# EAGLE design XStepperLCD (EAGLE 6.6.0)
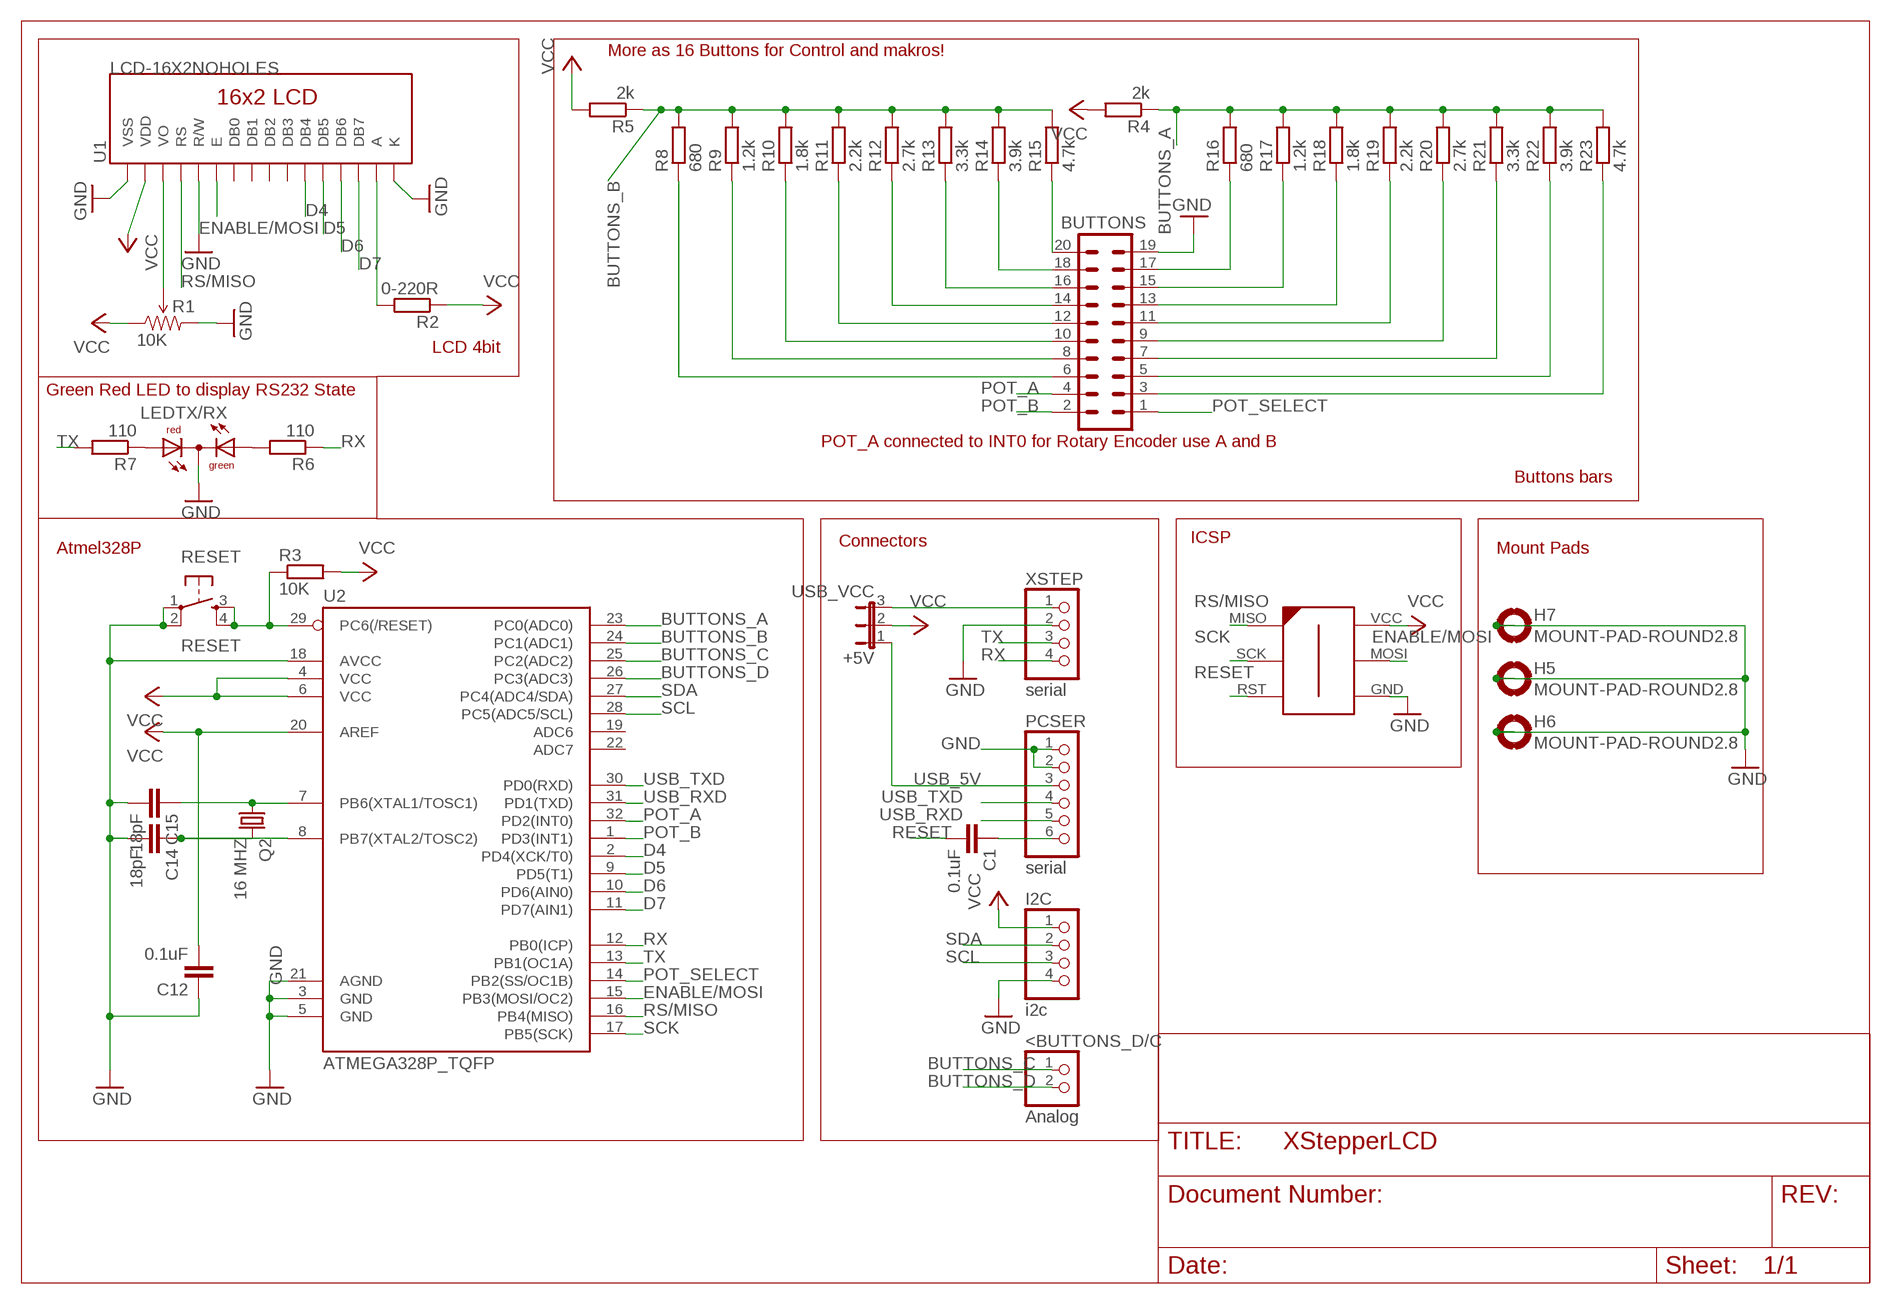
[diagram p0: schematic, sheet 1]

## Parts
+5V  USB_VCC  JP2E  [JP2]
<BUTTONS_D/C  Analog  PINHD-1X2  [1X02]
BUTTONS  ML20  [ML20]
C1  0.1uF  C-EUC1206  [C1206]
C12  0.1uF  C-EUC1206  [C1206]
C14  18pF  C-EUC1206  [C1206]
C15  18pF  C-EUC1206  [C1206]
H5  MOUNT-PAD-ROUND2.8  [2,8-PAD]
H6  MOUNT-PAD-ROUND2.8  [2,8-PAD]
H7  MOUNT-PAD-ROUND2.8  [2,8-PAD]
I2C  i2c  PINHD-1X4/90  [1X04/90]
ICSP  ICSP  AVR-ISP-6-EDGE  [6PAD_ISP]
LEDTX/RX  DUOLED2X5  [DUOLED2X5]
PCSER  serial  PINHD-1X6/90  [1X06/90]
Q2  16 MHZ  CRYSTALHC49S  [HC49/S]
R1  10K  TRIMPOT3362U-2  [3362U-2]
R2  0-220R  R-EU_R1206  [R1206]
R3  10K  R-EU_R1206  [R1206]
R4  2k  R-EU_R1206  [R1206]
R5  2k  R-EU_R1206  [R1206]
R6  110  R-EU_R1206  [R1206]
R7  110  R-EU_R1206  [R1206]
R8  680  R-EU_R1206  [R1206]
R9  1.2k  R-EU_R1206  [R1206]
R10  1.8k  R-EU_R1206  [R1206]
R11  2.2k  R-EU_R1206  [R1206]
R12  2.7k  R-EU_R1206  [R1206]
R13  3.3k  R-EU_R1206  [R1206]
R14  3.9k  R-EU_R1206  [R1206]
R15  4.7k  R-EU_R1206  [R1206]
R16  680  R-EU_R1206  [R1206]
R17  1.2k  R-EU_R1206  [R1206]
R18  1.8k  R-EU_R1206  [R1206]
R19  2.2k  R-EU_R1206  [R1206]
R20  2.7k  R-EU_R1206  [R1206]
R21  3.3k  R-EU_R1206  [R1206]
R22  3.9k  R-EU_R1206  [R1206]
R23  4.7k  R-EU_R1206  [R1206]
RESET  RESET  TAC_SWITCHSMD  [TACTILE_SWITCH_SMD]
U1  LCD-16X2NOHOLES  [LCD-16X2_NOHOLES]
U2  ATMEGA328P_TQFP  [TQFP32-08]
XSTEP  serial  PINHD-1X4/90  [1X04/90]

## Nets
BUTTONS_A: R4.1 R16.2 R17.2 R18.2 R19.2 R20.2 R21.2 R22.2 R23.2 U2.23(PC0(ADC0))
BUTTONS_B: R5.1 R8.2 R9.2 R10.2 R11.2 R12.2 R13.2 R14.2 R15.2 U2.24(PC1(ADC1))
BUTTONS_C: <BUTTONS_D/C.1 U2.25(PC2(ADC2))
BUTTONS_D: <BUTTONS_D/C.2 U2.26(PC3(ADC3))
D4: U1.11(DB4) U2.2(PD4(XCK/T0))
D5: U1.12(DB5) U2.9(PD5(T1))
D6: U1.13(DB6) U2.10(PD6(AIN0))
D7: U1.14(DB7) U2.11(PD7(AIN1))
ENABLE/MOSI: ICSP.MOSI U1.6(E) U2.15(PB3(MOSI/OC2))
GND: BUTTONS.19 C12.1 C14.2 C15.2 H5.B2,8(MOUNT) H6.B2,8(MOUNT) H7.B2,8(MOUNT) I2C.4 ICSP.GND LEDTX/RX.K(C) PCSER.1 PCSER.2 R1.3(CW) RESET.1 RESET.2 U1.1(VSS) U1.5(R/W) U1.16(K) U2.3(GND) U2.5(GND) U2.18(AVCC) U2.21(AGND) XSTEP.2
N$1: R1.2(WIPER) U1.3(VO)
N$2: R2.2 U1.15(A)
N$4: BUTTONS.13 R18.1
N$5: BUTTONS.15 R17.1
N$6: BUTTONS.17 R16.1
N$7: BUTTONS.6 R8.1
N$8: BUTTONS.8 R9.1
N$9: BUTTONS.3 R23.1
N$10: BUTTONS.5 R22.1
N$11: BUTTONS.10 R10.1
N$12: BUTTONS.12 R11.1
N$13: BUTTONS.14 R12.1
N$14: C1.1 PCSER.6
N$15: BUTTONS.16 R13.1
N$16: BUTTONS.7 R21.1
N$17: BUTTONS.9 R20.1
N$18: BUTTONS.11 R19.1
N$19: BUTTONS.18 R14.1
N$20: BUTTONS.20 R15.1
N$21: LEDTX/RX.AG R6.2
N$22: LEDTX/RX.AR R7.1
N$33: C15.1 Q2.1 U2.7(PB6(XTAL1/TOSC1))
N$34: C14.1 Q2.2 U2.8(PB7(XTAL2/TOSC2))
POT_A: BUTTONS.4 U2.32(PD2(INT0))
POT_B: BUTTONS.2 U2.1(PD3(INT1))
POT_SELECT: BUTTONS.1 U2.14(PB2(SS/OC1B))
RESET: C1.2 ICSP.RST R3.1 RESET.3 RESET.4 U2.29(PC6(/RESET))
RS/MISO: ICSP.MISO U1.4(RS) U2.16(PB4(MISO))
RX: R6.1 U2.12(PB0(ICP)) XSTEP.4
SCK: ICSP.SCK U2.17(PB5(SCK))
SCL: I2C.3 U2.28(PC5(ADC5/SCL))
SDA: I2C.2 U2.27(PC4(ADC4/SDA))
TX: R7.2 U2.13(PB1(OC1A)) XSTEP.3
USB_5V: +5V.1 PCSER.3
USB_RXD: PCSER.5 U2.31(PD1(TXD))
USB_TXD: PCSER.4 U2.30(PD0(RXD))
VCC [power]: +5V.2 C12.2 I2C.1 ICSP.VCC R1.1(CCW) R2.1 R3.2 R4.2 R5.2 U1.2(VDD) U2.4(VCC) U2.6(VCC)
XSTEP_5V: +5V.3 XSTEP.1
Unconnected: U1.7(DB0) U1.8(DB1) U1.9(DB2) U1.10(DB3) U2.19(ADC6) U2.20(AREF) U2.22(ADC7)

## Notes on the sheet
- More as 16 Buttons for Control and makros!
- LCD 4bit
- Green Red LED to display RS232 State
- POT_A connected to INT0 for Rotary Encoder use A and B
- Buttons bars
- Connectors | ICSP
- Atmel328P | Mount Pads

## Library data of the parts
+5V = jumper:JP2E: JUMPER
<BUTTONS_D/C = pinhead:PINHD-1X2: PIN HEADER
BUTTONS = con-ml:ML20: HARTING; OC_FARNELL: unknown; OC_NEWARK: unknown
C1 C12 C14 C15 = resistor:C-EU: CAPACITOR, European symbol
H5-H7 = holes:MOUNT-PAD-ROUND: MOUNTING PAD, round
I2C XSTEP = pinhead:PINHD-1X4: PIN HEADER
ICSP = avr-7:AVR-ISP-6-EDGE: 6 pin edge connector for ISP with ATMEL MCUs. Developed by Craig Moates (craig at moates dot net). Library by David Blundell (blundar at gmail dot com). Often, even a 6 pin header is really inconvenient for board layout and/or production. This SMD-only header is our de-facto standard for using an edge connector for programming with the help of a 6pin/10pin to edge card adapter.
LEDTX/RX = led:DUOLED2X5: DUO LED 2 colors, 2.5 x 5 mm, recangle
PCSER = pinhead:PINHD-1X6: PIN HEADER
Q2 = crystal:CRYSTAL: CRYSTAL; OC_FARNELL: 1667008; OC_NEWARK: unknown
R1 = SparkFun-Electromechanical:TRIMPOT: Various small potentiometers for "set-and-forget" applications
R2-R23 = resistor:R-EU_: RESISTOR, European symbol
RESET = SparkFun:TAC_SWITCH: Momentary Switch Button commonly used for reset or general input. Spark Fun Electronics SKU : COM-00097
U1 = SparkFun-Displays:LCD-16X2: Standard text-only 16x2 parallel input LCD
U2 = SparkFun-DigitalIC:ATMEGA328P_TQFP; PROD_ID: IC-09069

## Net classes
0 default: width 0.254 mm, clearance 0.203 mm
1 power: width 0.254 mm, clearance 0.203 mm

## Board
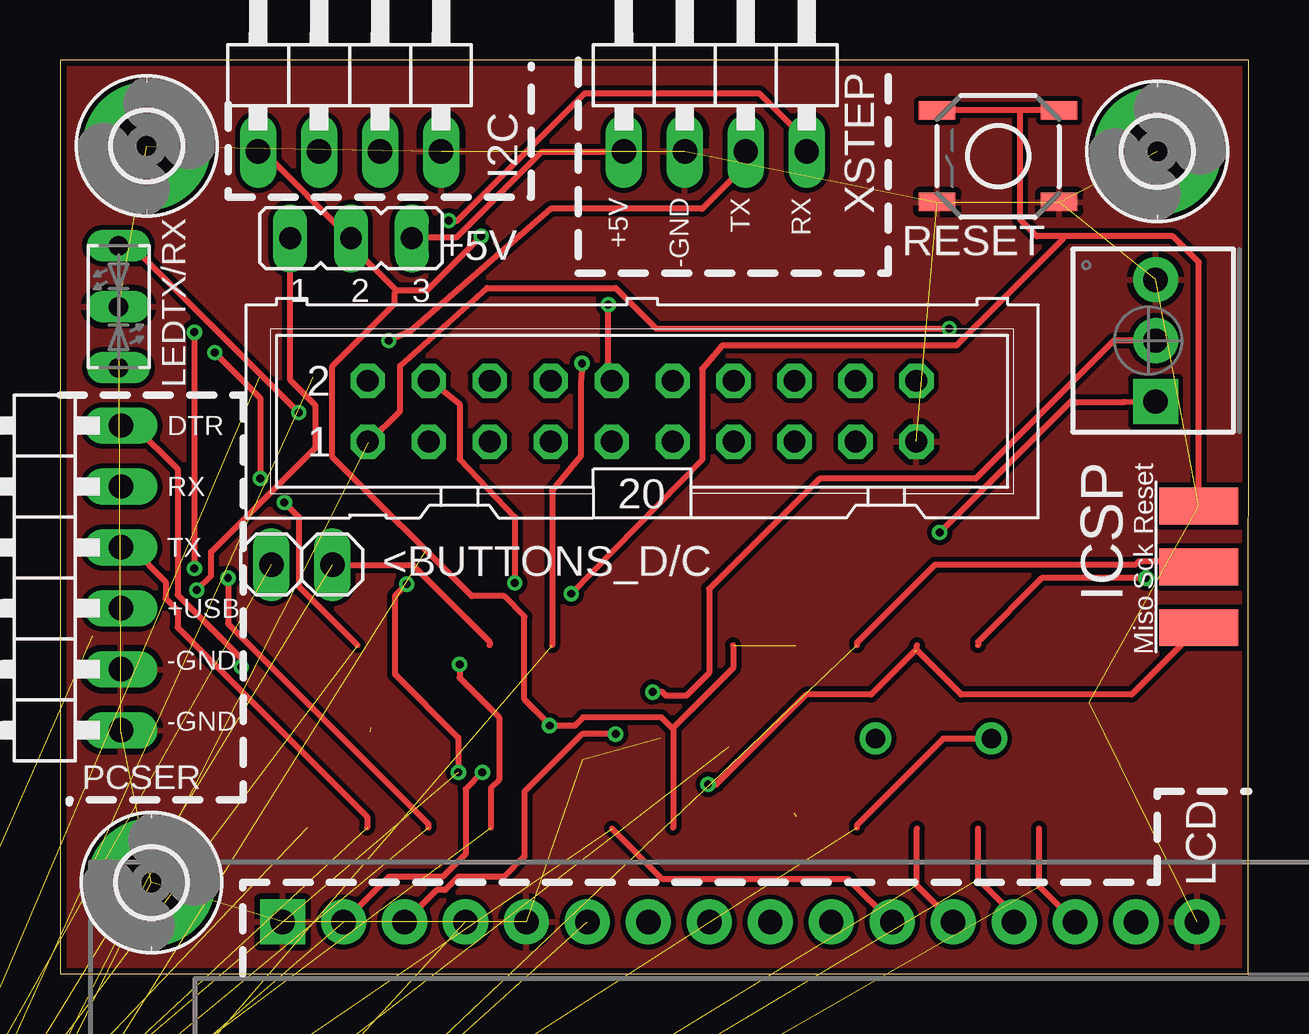
[diagram p1: board, top side]
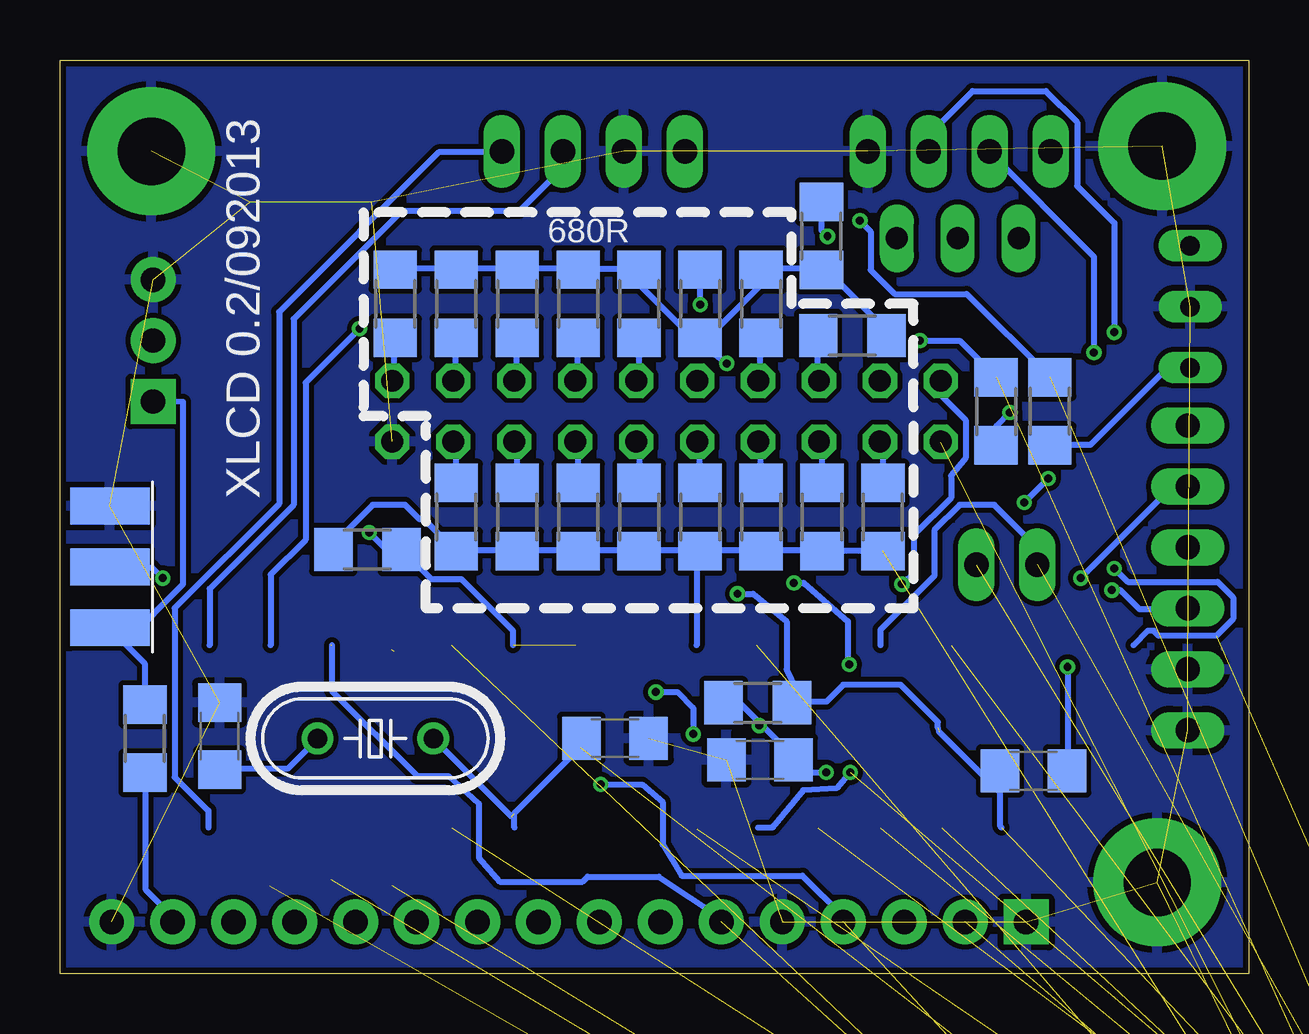
[diagram p2: board, bottom side, seen from below]

Size 49.53 x 38.1 mm. Coordinates in mm from the lower left corner, seen from the top.
Outline: 0,0 49.51,0 49.53,38.1 0,38.09 0,0
Copper layers (1*16): Top 0.035mm / dielectric 1.5mm / Bottom 0.035mm
Design rules "ITEADstudio_DRC": minimum track width 6mil, minimum drill 12mil, track to track 6mil, track to pad 6mil, pad to pad 6mil, via to via 6mil, smd to smd 0mil, copper to edge 10mil, drill to drill 10mil, minimum pad ring 10mil, minimum via ring 6mil, stop-mask expansion 2mil, vias tented up to drill 100mil, thermal gap 10mil

### Footprints (pad centres in the part's own frame; a part is rotated, then mirrored left to right if it is on the bottom)
JP2 = drill 0.914 long: 1 -2.54,0; 2 0,0; 3 2.54,0
1X02 = drill 1.016 long: 1 -1.27,0; 2 1.27,0
ML20 = drill 0.914 octagon: 1 -11.43,-1.27; 2 -11.43,1.27; 3 -8.89,-1.27; 4 -8.89,1.27; 5 -6.35,-1.27; 6 -6.35,1.27; 7 -3.81,-1.27; 8 -3.81,1.27; 9 -1.27,-1.27; 10 -1.27,1.27; 11 1.27,-1.27; 12 1.27,1.27; 13 3.81,-1.27; 14 3.81,1.27; 15 6.35,-1.27; 16 6.35,1.27; 17 8.89,-1.27; 18 8.89,1.27; 19 11.43,-1.27; 20 11.43,1.27
C1206 = smd 1.6 x 1.8: 1 -1.4,0; 2 1.4,0
2,8-PAD = drill 2.8 pad 5.334: B2,8 0,0
1X04/90 = drill 1.016 long: 1 -3.81,-3.81; 2 -1.27,-3.81; 3 1.27,-3.81; 4 3.81,-3.81
6PAD_ISP = smd 1.524 x 3.302 bottom: GND 2.54,0; MOSI 0,0; VCC -2.54,0 | smd 1.524 x 3.302: MISO -2.54,0; RST 2.54,0; SCK 0,0
DUOLED2X5 = drill 0.813 long: AG -2.54,0; AR 2.54,0; K 0,0
1X06/90 = drill 1.016 long: 1 -6.35,-3.81; 2 -3.81,-3.81; 3 -1.27,-3.81; 4 1.27,-3.81; 5 3.81,-3.81; 6 6.35,-3.81
HC49/S = drill 0.813: 1 -2.413,0; 2 2.413,0
3362U-2 = drill 1.016 pad 1.88 square: 1 -2.54,-0.305 | drill 1.016 pad 1.88: 2 0,-0.305; 3 2.54,-0.305
R1206 = smd 1.6 x 1.803: 1 -1.422,0; 2 1.422,0
TACTILE_SWITCH_SMD = smd 1.524 x 0.762: 1 -2.54,1.905; 2 2.54,1.905; 3 -2.54,-1.905; 4 2.54,-1.905
LCD-16X2_NOHOLES = drill 1.016 pad 1.88 square: 1 -32,15.5 | drill 1.016 pad 1.88: 2 -29.46,15.5; 3 -26.92,15.5; 4 -24.38,15.5; 5 -21.84,15.5; 6 -19.3,15.5; 7 -16.76,15.5; 8 -14.22,15.5; 9 -11.68,15.5; 10 -9.14,15.5; 11 -6.6,15.5; 12 -4.06,15.5; 13 -1.52,15.5; 14 1.02,15.5; 15 3.56,15.5; 16 6.1,15.5
TQFP32-08 = smd 1.27 x 0.559: 1 -4.293,2.8; 2 -4.293,2; 3 -4.293,1.2; 4 -4.293,0.4; 5 -4.293,-0.4; 6 -4.293,-1.2; 7 -4.293,-2; 8 -4.293,-2.8; 17 4.293,-2.8; 18 4.293,-2; 19 4.293,-1.2; 20 4.293,-0.4; 21 4.293,0.4; 22 4.293,1.2; 23 4.293,2; 24 4.293,2.8 | smd 0.559 x 1.27: 9 -2.8,-4.293; 10 -2,-4.293; 11 -1.2,-4.293; 12 -0.4,-4.293; 13 0.4,-4.293; 14 1.2,-4.293; 15 2,-4.293; 16 2.8,-4.293; 25 2.8,4.293; 26 2,4.293; 27 1.2,4.293; 28 0.4,4.293; 29 -0.4,4.293; 30 -1.2,4.293; 31 -2,4.293; 32 -2.8,4.293

### Placement (x,y rotation side)
+5V  12.12,30.67 0 top
<BUTTONS_D/C  10.08,17.06 180 top
BUTTONS  24.25,23.45 0 top
C1  8.96,8.46 180 bottom
C12  20.36,8.93 0 bottom
C14  42.88,9.91 90 bottom
C15  26.41,9.82 0 bottom
H5  3.61,34.52 0 top
H6  45.72,34.29 0 top
H7  3.81,3.81 0 top
I2C  12.06,38.1 0 top
ICSP  47.45,16.96 90 top
LEDTX/RX  2.44,27.82 90 top
PCSER  -1.27,16.51 90 top
Q2  36.39,9.81 180 bottom
R1  45.34,26.4 90 top
R2  45.99,9.81 270 bottom
R3  20.45,11.3 180 bottom
R4  36.72,17.69 0 bottom
R5  17.8,30.77 90 bottom
R6  8.29,23.45 270 bottom
R7  10.53,23.45 90 bottom
R8  16.52,26.61 0 bottom
R9  20.32,27.94 90 bottom
R10  22.86,27.94 270 bottom
R11  25.4,27.94 90 bottom
R12  27.94,27.94 90 bottom
R13  30.48,27.94 90 bottom
R14  33.02,27.94 90 bottom
R15  35.56,27.94 90 bottom
R16  33.02,19.05 270 bottom
R17  30.48,19.05 270 bottom
R18  27.94,19.05 270 bottom
R19  25.4,19.05 270 bottom
R20  22.86,19.05 270 bottom
R21  20.32,19.05 270 bottom
R22  17.78,19.05 270 bottom
R23  15.24,19.05 270 bottom
RESET  39.09,34.09 180 top
U1  41.27,-13.34 0 top
U2  -13.97,-24.13 0 top  (outside the outline)
XSTEP  27.3,38.1 0 top

### Tracks (layer width: path | path; a pad name or v marks a point on that pad's centre or on a via)
BUTTONS_A  (1 unrouted)
  Bottom 0.254: R23.2 15.25,17.65 17.75,17.65 R22.2 17.9,17.65 20.3,17.65 R21.2 20.4,17.65 22.85,17.65 R20.2 | R20.2 22.95,17.65 25.4,17.65 R19.2 25.5,17.65 27.9,17.65 R18.2 28.05,17.65 30.45,17.65 R17.2 30.6,17.65 33,17.65 R16.2 33.1,17.7 34.35,18.95 34.55,18.95 35.15,19.55 36.5,19.55 38.1,17.95 38.1,17.7 R4.1 | 23,13.7 23,17.55 R20.2
BUTTONS_B  (via drill 0.33)  (1 unrouted)
  Top 0.254: 20.5,13.7 20.5,20.15 21.7,21.6 21.7,24.62 v21.75,25.45
  Bottom 0.254: R15.2 35.55,29.4 33.1,29.4 R14.2 33,29.4 30.6,29.4 R13.2 30.45,29.4 28.05,29.4 R12.2 27.9,29.4 25.4,29.4 R11.2 25.35,29.25 25.35,28.7 23.25,26.6 22.95,26.6 R10.2 | R8.2 15.1,26.65 15.1,26.85 17.55,29.3 17.8,29.3 R5.1 17.9,29.4 20.3,29.4 R9.2 19.75,29.3 22.5,26.55 22.85,26.55 R10.2 | v21.75,25.45 22.32,25.9 22.45,26.45 R10.2
BUTTONS_C  (1 unrouted)
  Top 0.254: 17.9,13.7 17.9,13.85 14.7,17.05 <BUTTONS_D/C.1
BUTTONS_D  (1 unrouted)
  Bottom 0.254: 15.35,13.7 15.35,14.35 13.1,16.6 13.1,18.5 12.05,19.55 10.6,19.55 8.85,17.8 8.85,17.1 <BUTTONS_D/C.2
D4  (1 unrouted)
  Top 0.254: 23,6.05 25.1,3.95 32.85,3.95 34.65,2.15 U1.11
D5  (1 unrouted)
  Top 0.254: 35.7,6.05 35.7,3.7 37.2,2.2 U1.12
D6  (1 unrouted)
  Top 0.254: 38.25,6.05 38.25,3.95 39.75,2.45 39.75,2.2 U1.13
D7  (1 unrouted)
  Top 0.254: 40.8,6.05 40.8,3.65 42.25,2.2 U1.14
ENABLE/MOSI  (via drill 0.33)  (2 unrouted)
  Top 0.254: 38.25,13.7 38.25,13.85 40.9,16.5 v45.25,16.5
  Bottom 0.254: v45.25,16.5 45.7,16.95 ICSP.MOSI | 38.2,13.7 38.2,11.8 34.65,8.25 33.35,8.25 32.08,7.1 32.08,4.85 31.2,3.85 27.75,3.85 27.55,4.05 24.57,4.05 22,2.35 22,2.2 U1.6
GND  (22 unrouted)
  pour Bottom: 0,0 49.53,0 49.53,38.1 0,38.1
  pour Top: 0,38.1 49.53,38.1 49.53,0 0,0
N$1  (via drill 0.33)
  Top 0.254: v23.15,10 21.75,10 19.35,7.6 19.35,4.9 18.5,4.05 16.6,4.05 16.05,3.5 15.7,3.5 14.4,2.2 U1.3 | v24.7,11.75 25.1,11.75 25.25,11.6 26.1,11.6 27.05,12.55 27.05,16.05 31.65,20.65 38.15,20.65 43.9,26.4 R1.2
  Bottom 0.254: v23.15,10 23.15,11.1 23.8,11.75 v24.7,11.75
N$2
  Bottom 0.254: R2.2 45.95,8.35 45.95,3.5 44.85,2.4 44.85,2.2 U1.15
N$4
  Bottom 0.254: R18.1 27.95,20.5 27.95,22.05 28.05,22.15 BUTTONS.13
N$5
  Bottom 0.254: R17.1 30.5,20.5 30.5,22.05 30.6,22.15 BUTTONS.15
N$6
  Bottom 0.254: R16.1 33.05,20.5 33.05,22.1 33.1,22.15 BUTTONS.17
N$7
  Bottom 0.254: R8.1 17.95,24.75 BUTTONS.6
N$8
  Bottom 0.254: R9.1 20.35,26.5 20.35,24.8 20.4,24.75 BUTTONS.8
N$9
  Bottom 0.254: R23.1 15.25,20.5 15.25,22.05 15.35,22.15 BUTTONS.3
N$10
  Bottom 0.254: R22.1 17.8,20.5 17.8,22.05 17.9,22.15 BUTTONS.5
N$11  (via drill 0.33)
  Top 0.254: v22.85,27.9 22.85,24.85 22.95,24.75 BUTTONS.10
  Bottom 0.254: v22.85,27.9 R10.1
N$12
  Bottom 0.254: R11.1 25.4,24.85 BUTTONS.12
N$13
  Bottom 0.254: R12.1 27.95,26.5 27.95,24.85 28.05,24.75 BUTTONS.14
N$14  (via drill 0.33)
  Top 0.254: v7.55,12.8 7.55,13.15 4.9,15.8 4.9,21.05 3.1,22.85 PCSER.6
  Bottom 0.254: v7.55,12.8 7.55,8.5 C1.1
N$15
  Bottom 0.254: R13.1 30.5,26.5 30.5,24.85 30.6,24.75 BUTTONS.16
N$16
  Bottom 0.254: R21.1 20.35,20.5 20.35,22.1 20.4,22.15 BUTTONS.7
N$17
  Bottom 0.254: BUTTONS.9 22.9,22.1 22.9,20.5 R20.1
N$18
  Bottom 0.254: R19.1 25.4,22.05 25.5,22.15 BUTTONS.11
N$19
  Bottom 0.254: R14.1 33.05,26.5 33.05,24.8 33.1,24.75 BUTTONS.18
N$20
  Bottom 0.254: R15.1 35.6,26.5 35.6,24.8 35.65,24.75 BUTTONS.20
N$21
  Bottom 0.254: R6.2 8.25,22.05 6.6,22.05 3.4,25.25 2.45,25.25 LEDTX/RX.AG
N$22  (via drill 0.33)
  Top 0.254: v9.95,23.4 3,30.35 LEDTX/RX.AR
  Bottom 0.254: v9.95,23.4 10.5,22.85 10.5,22.05 R7.1
N$33  (2 unrouted)
  Bottom 0.254: 30.6,6.1 30.6,6.7 27.85,9.45 27.85,9.8 C15.1 | 30.7,6.55 33.95,9.8 Q2.1
N$34  (1 unrouted)
  Top 0.254: 33.2,6.1 33.2,6.2 36.8,9.8 Q2.2
  Bottom 0.254: C14.1 42.85,8.55 40.05,8.55 Q2.2
POT_A  (via drill 0.33)  (1 unrouted)
  Top 0.254: 17.95,6.1 17.95,7.75 18.3,8.1 18.3,10.7 16.65,12.35 v16.65,12.9 | v18.95,16.3 18.95,19.05 16.65,21.48 16.65,23.75 15.4,24.75 BUTTONS.4
  Bottom 0.254: v16.65,12.9 16.7,13.07 16.7,14.7 18.55,16.3 v18.95,16.3
POT_B  (via drill 0.33)  (1 unrouted)
  Top 0.254: v16.6,8.4 16.6,9.85 13.95,12.5 13.95,15.75 v14.45,16.25
  Bottom 0.254: 20.45,6.1 19.85,6.1 18.57,7.66 17.17,7.74 v16.6,8.4 | v14.45,16.25 14.25,16.45 14.2,16.45 13.95,16.7 13.95,18.3 12.4,19.85 12.4,20.77 11.8,21.5 11.8,23.1 12.8,24.1 12.8,24.7 BUTTONS.2
POT_SELECT  (via drill 0.33)  (1 unrouted)
  Top 0.254: v37.05,26.9 24.85,26.9 23.15,28.6 17.8,28.6 14.18,25.35 14.18,23.48 12.85,22.15 BUTTONS.1
  Bottom 0.254: 40.75,13.7 40.75,16.65 39.3,18.1 39.3,24.65 v37.05,26.9
RESET  (via drill 0.33)  (2 unrouted)
  Top 0.254: 40,36 41.6,36 RESET.3 | 40,36 RESET.4 | 40,36 40,31.45 40.7,30.75 41.8,30.75 | 41.8,30.75 46.37,30.75 47.45,29.67 ICSP.RST | v21.3,15.85 26.75,21.43 26.75,25.23 27.6,26.2 37.35,26.2 41.8,30.65 41.8,30.75
  Bottom 0.254: 10.3,6.1 10.35,6.15 10.35,8.45 C1.2 10.45,7.65 12.9,10.1 | 12.95,10.25 12.95,10.5 14.5,12.05 16.9,12.05 17.6,11.35 19,11.35 R3.1 19.05,11.45 19.05,12.25 19.25,12.7 19.25,14.7 20.65,15.85 v21.3,15.85
RS/MISO  (via drill 0.33)  (2 unrouted)
  Top 0.254: 35.7,13.7 35.7,13.5 37.55,11.65 44.65,11.65 47.45,14.45 ICSP.MISO | v27,7.9 27.35,7.9 31.1,11.65 33.8,11.65 35.6,13.45
  Bottom 0.254: v27,7.9 25.27,7.9 24.43,7.17 24.43,5.4 23.62,4.1 18.6,4.1 16.9,2.4 16.9,2.2 U1.4
RX  (via drill 0.33)  (1 unrouted)
  Top 0.254: v16.2,31.4 16.55,31.4 21.85,36.7 29.15,36.7 31.1,34.75 XSTEP.4
  Bottom 0.254: v16.2,31.4 15.75,30.95 15.75,29.35 14.75,28.35 11.75,28.35 8.3,24.9 R6.1 | 43.35,6.1 43.35,6.8 44.75,8.2 44.75,15.25 40.4,19.6 40.4,27.6 33.75,34.25 31.15,34.25 XSTEP.4
SCK  (1 unrouted)
  Top 0.254: 33.2,13.7 33.2,13.8 36.45,17.05 44.8,17.05 44.95,17.2 47.25,17.2 47.45,17 ICSP.SCK
SCL  (via drill 0.33)  (1 unrouted)
  Top 0.254: v5.6,26.75 v5.6,16.9
  Bottom 0.254: 4.8,13.7 4.2,14.3 3.95,14.3 3.75,14.1 1.35,14.1 0.65,14.8 0.65,15.7 1.3,16.35 5.05,16.35 v5.6,16.9 | v5.6,26.75 5.6,31.3 7.15,32.85 7.15,35.5 8.45,36.8 11.5,36.8 13.3,35 13.3,34.3 I2C.3
SDA  (via drill 0.33)  (1 unrouted)
  Top 0.254: 12.4,13.7 9.95,16.15 9.95,19.05 v9.35,19.65 | v8.35,20.65 8.35,24 v6.45,25.9
  Bottom 0.254: v8.35,20.65 v9.35,19.65 | v6.45,25.9 6.45,29.9 10.8,34.25 I2C.2
TX  (via drill 0.33)  (1 unrouted)
  Top 0.254: v13.7,26.4 14.57,26.77 20.45,31.9 26.75,31.9 28.55,33.7 28.55,34.25 XSTEP.3
  Bottom 0.254: v13.7,26.4 12.05,26.4 10.55,24.9 R7.2 | 43.3,13.7 43.3,16.05 39.8,19.55 39.8,27.3 35.3,31.8 30.4,31.8 28.6,33.6 28.6,34.25 XSTEP.3
USB_5V  (via drill 0.33)
  Top 0.254: v5.7,16 6.3,16.6 6.3,17.6 10.65,21.95 10.65,23.7 9.6,24.75 9.6,30.65 +5V.1
  Bottom 0.254: v5.7,16 5.35,16 4.55,15.2 2.55,15.2 PCSER.3
USB_RXD  (via drill 0.33)  (1 unrouted)
  Top 0.254: 15.35,6.1 15.35,6.25 7,14.6 v7,16.5
  Bottom 0.254: v7,16.5 3.2,20.3 2.55,20.3 PCSER.5
USB_TXD  (1 unrouted)
  Top 0.254: 12.8,6.1 12.8,6.55 4.9,14.45 4.9,15.15 4.4,15.65 4.4,16.35 3,17.75 2.55,17.75 PCSER.4
VCC  (via drill 0.33)  (3 unrouted)
  Top 0.254: v17.55,30.75 15.3,28.5 14,28.5 | 14,28.5 12.15,30.35 12.15,30.65 +5V.2 12.05,30.7 8.5,34.25 8.3,34.25 I2C.1 | 25.55,10.25 25.55,6.1 | 25.55,10.25 28.05,12.75 28.05,13.7 | 25.55,10.25 25.45,10.3 25.05,10.7 21.8,10.7 21.45,10.35 v20.4,10.35 20.35,10.45 19.35,11.45 19.35,14.9 18.5,15.75 17.15,15.75 11.35,21.55 11.35,25.35 13.95,27.95 13.95,28.4 14,28.5 | U1.2 13.7,4.05 15.95,4.05 16.9,5 16.9,7.7 v17.6,8.4 | v36.65,18.4 42.1,23.85 44.35,23.85 R1.1
  Bottom 0.254: R2.1 46,11.25 46,12.95 47.45,14.4 ICSP.VCC 46.8,13.85 44.4,16.25 44.4,23.85 R1.1 | v17.55,30.75 17.8,31 17.8,32.15 R5.2 | 30.65,13.7 30.65,14.3 32.8,16.45 34.05,16.45 35.25,17.65 R4.2 35.4,17.75 36,17.75 v36.65,18.4 | 20.32,10.43 21.2,11.3 21.85,11.3 R3.2 | 20.32,10.43 19,9.1 19,8.95 C12.2 18.85,8.9 18.35,8.4 v17.6,8.4 | v20.4,10.35 20.32,10.43
XSTEP_5V
  Top 0.254: +5V.3 14.7,30.7 16.5,30.7 20.05,34.25 23.45,34.25 XSTEP.1

### Text on the board
tNames: +5V | -GND | TX | RX | DTR | RX | Reset | TX | ICSP | Sck | +USB | -GND | Miso | -GND | LCD
bNames: XLCD 0.2/092013 | 680R